# EAGLE design bbtc-logic (EAGLE 6.5.0)
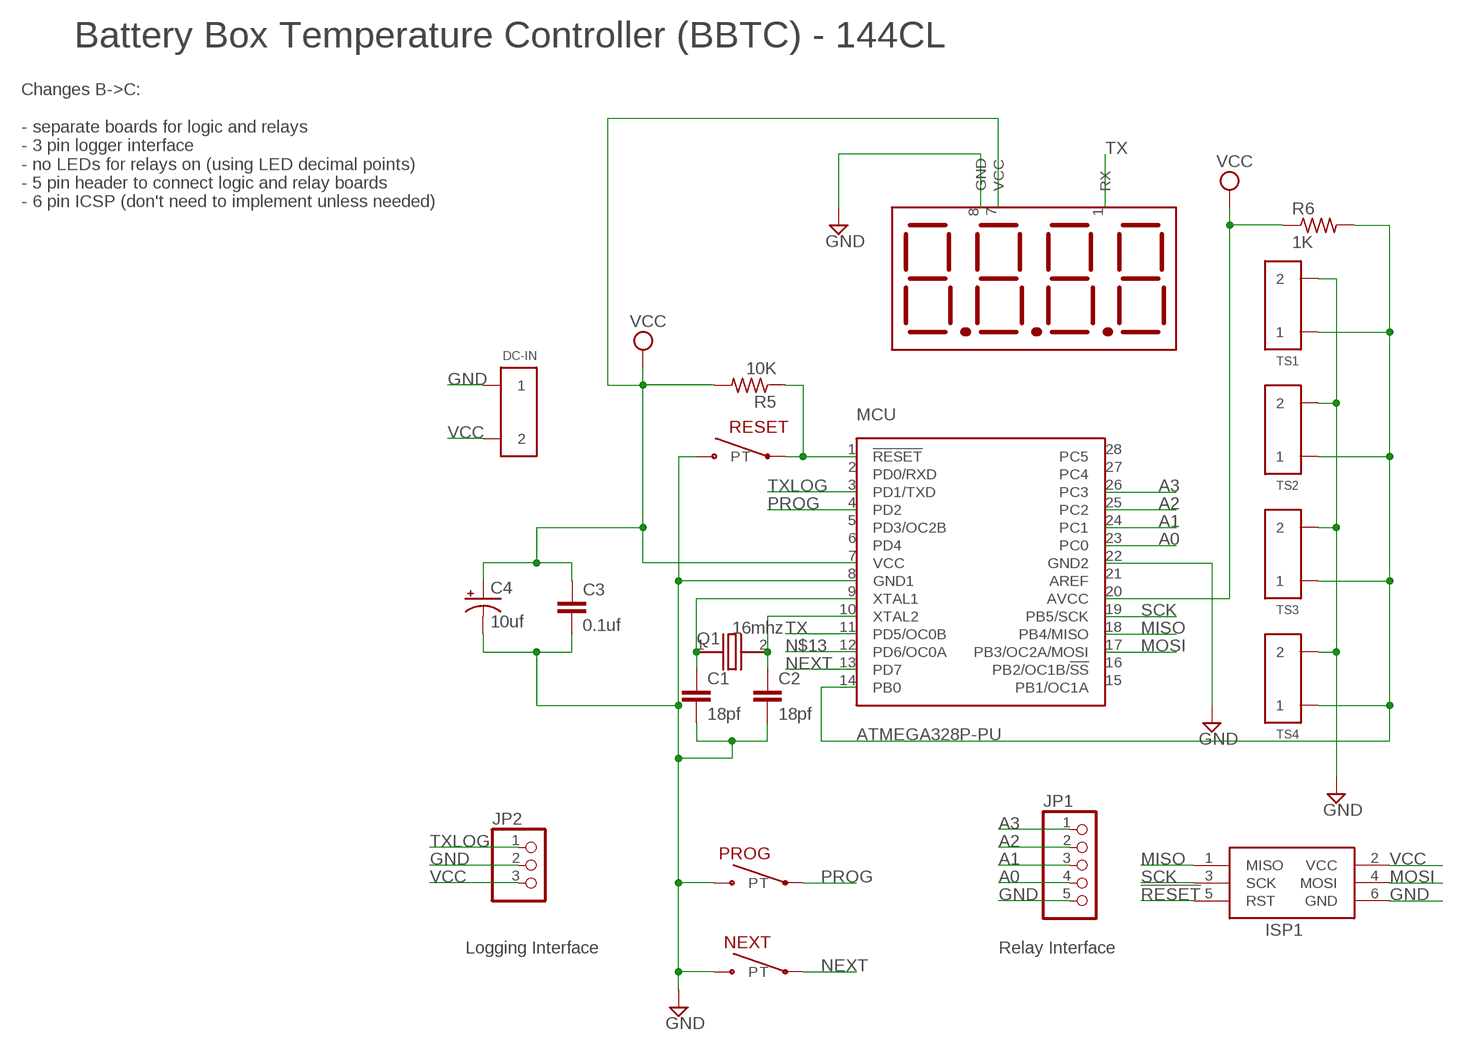
[diagram p0: schematic, sheet 1]

## Parts
4-DIG-DISPLAY  4-DIGIT-DISPLAY  [3SIL-OF-8]
C1  18pf  C-EUC0805  [C0805]
C2  18pf  C-EUC0805  [C0805]
C3  0.1uf  C-EUC0805  [C0805]
C4  10uf  CPOL-USE2-4  [E2-4]
DC-IN  SCREW-CLAMP-1255  [SCREW-CLAMP-ADAFRUIT-2X3.5MM]
ISP1  AVRISP-6  [AVRISP]
JP1  PINHD-1X5  [1X05]
JP2  PINHD-1X3  [1X03]
MCU  ATMEGA328P-PU  [DIL28-3]
NEXT  SWITCH-SPST-NEW  [SWITCH-ADAFRUIT-6MM-SLIM]
PROG  SWITCH-SPST-NEW  [SWITCH-ADAFRUIT-6MM-SLIM]
Q1  16mhz  CRYSTAL-5X3.2MM1024  [CRYSTAL-5X3.2MM-1024]
R5  10K  R-US_R0805  [R0805]
R6  1K  R-US_M0805  [M0805]
RESET  SWITCH-SPST-NEW  [SWITCH-ADAFRUIT-6MM-SLIM]
TS1  SCREW-CLAMP-1255  [SCREW-CLAMP-ADAFRUIT-2X3.5MM]
TS2  SCREW-CLAMP-1255  [SCREW-CLAMP-ADAFRUIT-2X3.5MM]
TS3  SCREW-CLAMP-1255  [SCREW-CLAMP-ADAFRUIT-2X3.5MM]
TS4  SCREW-CLAMP-1255  [SCREW-CLAMP-ADAFRUIT-2X3.5MM]

## Nets
1W: MCU.14(PB0) R6.2 TS1.1 TS2.1 TS3.1 TS4.1
!RESET: ISP1.5(RST) MCU.1(!RESET) R5.1 RESET.T
A0: JP1.4 MCU.23(PC0)
A1: JP1.3 MCU.24(PC1)
A2: JP1.2 MCU.25(PC2)
A3: JP1.1 MCU.26(PC3)
GND: 4-DIG-DISPLAY.8(GND) C1.2 C2.2 C3.2 C4.- DC-IN.1 ISP1.6(GND) JP1.5 JP2.2 MCU.8(GND1) MCU.22(GND2) NEXT.P PROG.P RESET.P TS1.2 TS2.2 TS3.2 TS4.2
MISO: ISP1.1(MISO) MCU.18(PB4/MISO)
MOSI: ISP1.4(MOSI) MCU.17(PB3/OC2A/MOSI)
N$4: C1.1 MCU.9(XTAL1) Q1.1
N$7: C2.1 MCU.10(XTAL2) Q1.2
N$13: MCU.12(PD6/OC0A)
NEXT: MCU.13(PD7) NEXT.T
PROG: MCU.4(PD2) PROG.T
SCK: ISP1.3(SCK) MCU.19(PB5/SCK)
TX: 4-DIG-DISPLAY.1(RX) MCU.11(PD5/OC0B)
TXLOG: JP2.1 MCU.3(PD1/TXD)
VCC: 4-DIG-DISPLAY.7(VCC) C3.1 C4.+ DC-IN.2 ISP1.2(VCC) JP2.3 MCU.7(VCC) MCU.20(AVCC) R5.2 R6.1
Unconnected: MCU.2(PD0/RXD) MCU.5(PD3/OC2B) MCU.6(PD4) MCU.15(PB1/OC1A) MCU.16(PB2/OC1B/!SS) MCU.21(AREF) MCU.27(PC4) MCU.28(PC5)

## Notes on the sheet
- Battery Box Temperature Controller (BBTC) - 144CL
- Changes B->C:
  
  - separate boards for logic and relays
  - 3 pin logger interface
  - no LEDs for relays on (using LED decimal points)
  - 5 pin header to connect logic and relay boards
  - 6 pin ICSP (don't need to implement unless needed)
- Logging Interface | Relay Interface

## Library data of the parts
4-DIG-DISPLAY = trl:4-DIGIT-DISPLAY
C1-C3 = rcl:C-EU: CAPACITOR, European symbol
C4 = rcl:CPOL-US: POLARIZED CAPACITOR, American symbol
DC-IN TS1-TS4 = trl:SCREW-CLAMP-1255
ISP1 = adafruit:AVRISP: AVR ISP HEADER Standard 6 pin header for AVR programming
JP1 = pinhead:PINHD-1X5: PIN HEADER
JP2 = pinhead:PINHD-1X3: PIN HEADER
MCU = trl:ATMEGA328P-PU
NEXT PROG RESET = trl:SWITCH-SPST-NEW
Q1 = trl:CRYSTAL-5X3.2MM
R5 = rcl:R-US_: RESISTOR, American symbol
R6 = resistor:R-US_: RESISTOR, American symbol

## Board
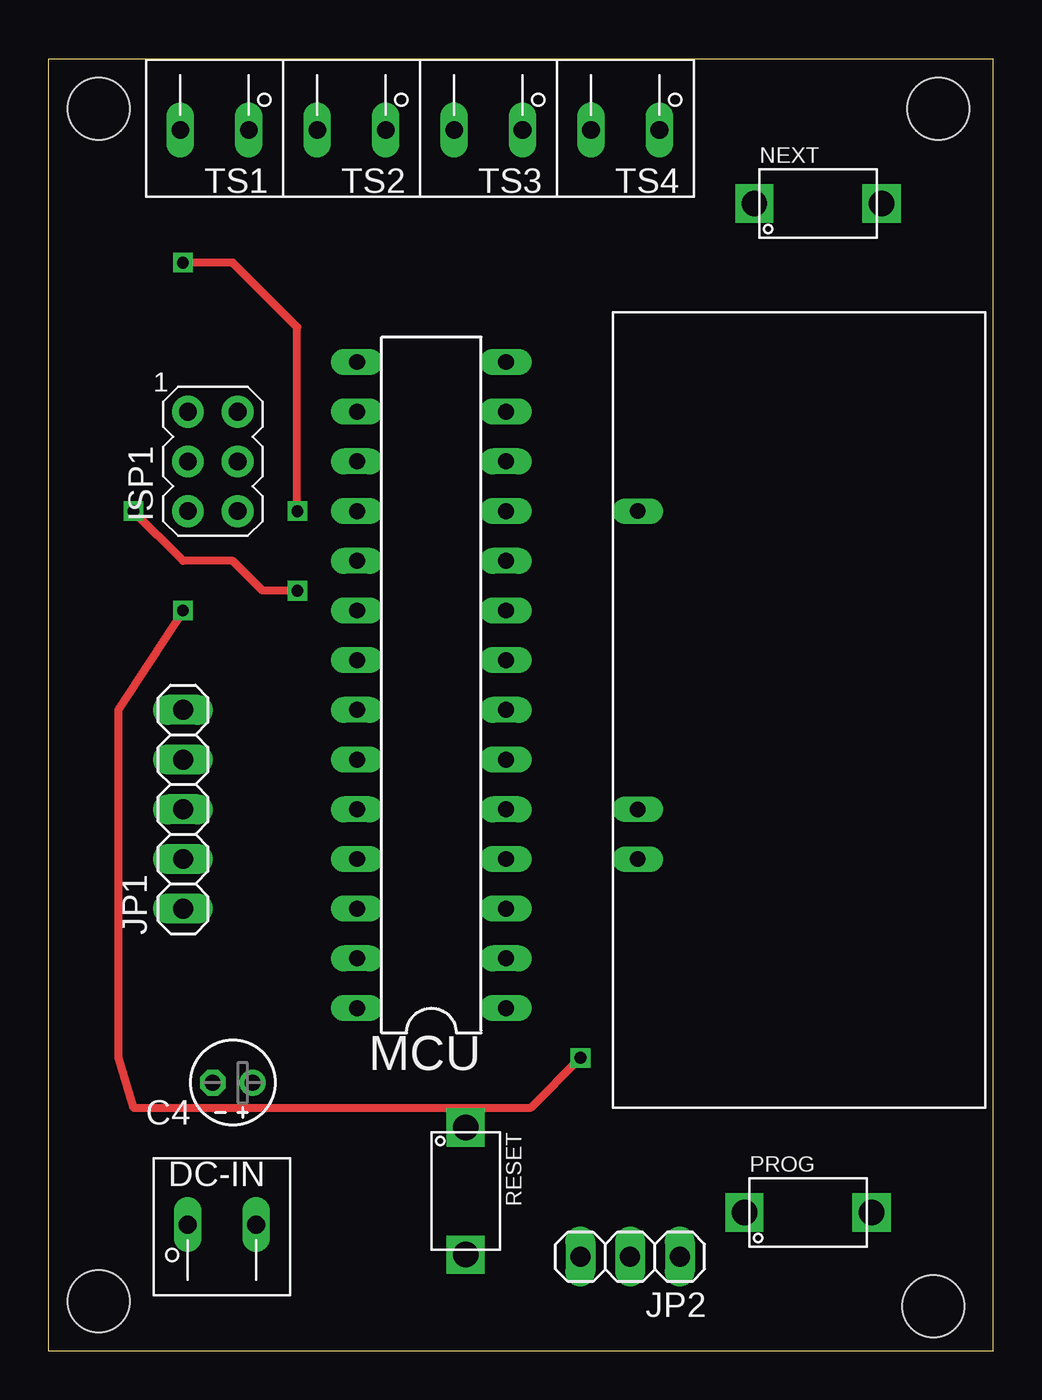
[diagram p1: board, top side]
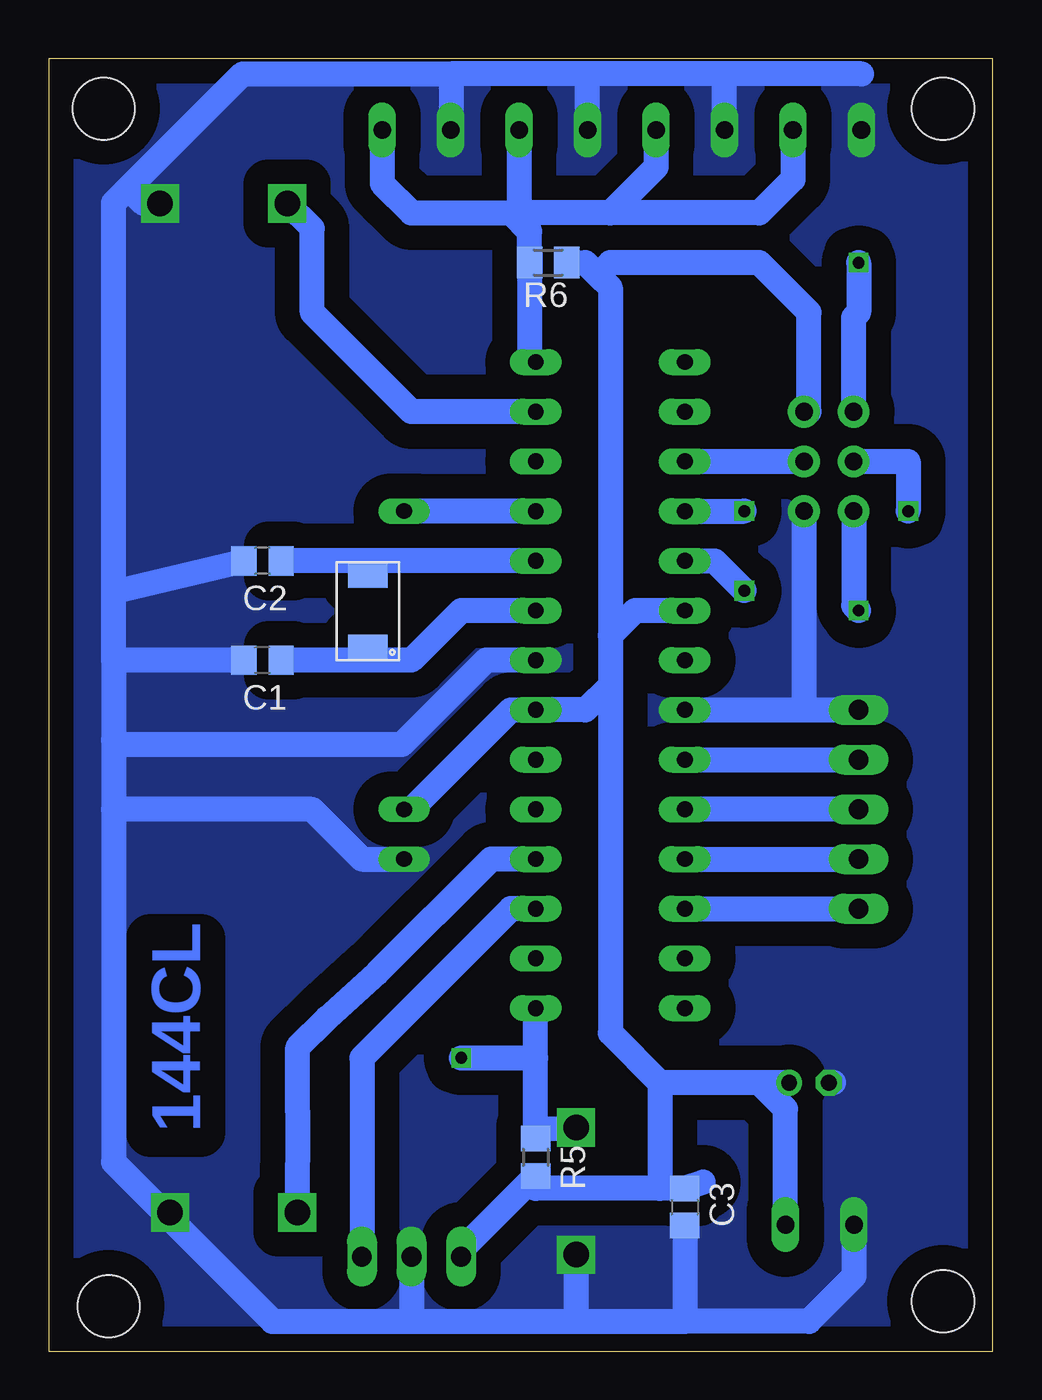
[diagram p2: board, bottom side, seen from below]

Size 48.26 x 66.04 mm. Coordinates in mm from the lower left corner, seen from the top.
Outline: 0,66.04 48.26,66.04 48.26,0 0,0 0,66.04
Copper layers (1*16): Top 0.035mm / dielectric 1.5mm / Bottom 0.035mm
Design rules "default": minimum track width 10mil, minimum drill 24mil, track to track 8mil, track to pad 8mil, pad to pad 8mil, via to via 8mil, smd to smd 8mil, copper to edge 40mil, drill to drill 8mil, minimum pad ring 10mil, minimum via ring 8mil, stop-mask expansion 4mil, vias tented up to drill 0mil, thermal gap 10mil
Holes 3.17 mm at 2.54,63.5 45.47,63.5 45.21,2.29 2.54,2.54

### Footprints (pad centres in the part's own frame; a part is rotated, then mirrored left to right if it is on the bottom)
3SIL-OF-8 = drill 0.8 long: 1 30.48,-1.27; 7 15.24,-1.27; 8 12.7,-1.27
C0805 = smd 1.3 x 1.5: 1 -0.95,0; 2 0.95,0
E2-4 = drill 0.813 pad 1.27: + -1.016,0 | drill 0.813 pad 1.27 octagon: - 1.016,0
SCREW-CLAMP-ADAFRUIT-2X3.5MM = drill 0.9 long: 1 1.75,3.6; 2 5.25,3.6
AVRISP = drill 0.9 pad 1.626: 1 -1.27,2.54; 2 1.27,2.54; 3 -1.27,0; 4 1.27,0; 5 -1.27,-2.54; 6 1.27,-2.54
1X05 = drill 1.016 long: 1 -5.08,0; 2 -2.54,0; 3 0,0; 4 2.54,0; 5 5.08,0
1X03 = drill 1.016 long: 1 -2.54,0; 2 0,0; 3 2.54,0
DIL28-3 = drill 0.813 long: 1 -16.51,-3.81; 2 -13.97,-3.81; 3 -11.43,-3.81; 4 -8.89,-3.81; 5 -6.35,-3.81; 6 -3.81,-3.81; 7 -1.27,-3.81; 8 1.27,-3.81; 9 3.81,-3.81; 10 6.35,-3.81; 11 8.89,-3.81; 12 11.43,-3.81; 13 13.97,-3.81; 14 16.51,-3.81; 15 16.51,3.81; 16 13.97,3.81; 17 11.43,3.81; 18 8.89,3.81; 19 6.35,3.81; 20 3.81,3.81; 21 1.27,3.81; 22 -1.27,3.81; 23 -3.81,3.81; 24 -6.35,3.81; 25 -8.89,3.81; 26 -11.43,3.81; 27 -13.97,3.81; 28 -16.51,3.81
SWITCH-ADAFRUIT-6MM-SLIM = drill 1.3 square: P 3.71,0.48; T -2.79,0.48
CRYSTAL-5X3.2MM-1024 = smd 1.3 x 2: 1 0.65,1.6; 2 4.35,1.6
R0805 = smd 1.3 x 1.5: 1 -0.95,0; 2 0.95,0
M0805 = smd 1.3 x 1.6: 1 -0.95,0; 2 0.95,0

### Placement (x,y rotation side)
4-DIG-DISPLAY  28.83,12.45 90 top
C1  37.34,35.31 180 bottom
C2  37.34,40.39 180 bottom
C3  15.75,7.37 270 bottom
C4  9.4,13.72 180 top
DC-IN  5.35,2.86 0 top
ISP1  8.38,45.47 0 top
JP1  6.86,27.69 90 top
JP2  29.72,4.83 180 top
MCU  19.56,34.04 90 top
NEXT  38.86,58.17 0 top
PROG  38.35,6.6 0 top
Q1  30.35,35.31 90 bottom
R5  23.37,9.91 270 bottom
R6  22.73,55.63 180 bottom
RESET  20.83,8.64 270 top
TS1  11.97,66 180 top
TS2  18.97,66 180 top
TS3  25.97,66 180 top
TS4  32.97,66 180 top

### Tracks (layer width: path | path; a pad name or v marks a point on that pad's centre or on a via)
1W
  Bottom 0.813: 24.22,58.59 24.64,58.17
  Bottom 1.27: 24.64,58.17 23.68,57.21 R6.2 23.68,50.86 MCU.14 | TS4.1 31.22,59.67 29.72,58.17 24.64,58.17 | TS3.1 24.22,58.59 | TS2.1 17.22,60.51 19.56,58.17 | 19.56,58.17 24.64,58.17 | TS1.1 10.22,59.89 11.94,58.17 19.56,58.17
!RESET  (via drill 0.6)
  Top 0.406: v6.86,37.85 3.56,32.77 3.56,14.99 4.32,12.45 24.64,12.45 v27.18,14.99
  Bottom 1.27: RESET.T 23.28,11.36 R5.1 23.37,14.99 | 23.37,14.99 MCU.1 | ISP1.5 7.11,38.1 v6.86,37.85 | v27.18,14.99 23.37,14.99
A0
  Bottom 1.27: MCU.23 JP1.4
A1
  Bottom 1.27: JP1.3 MCU.24
A2
  Bottom 1.27: MCU.25 JP1.2
A3
  Bottom 1.27: MCU.26 JP1.1
GND
  Bottom 1.27: 4-DIG-DISPLAY.8 32.26,25.15 34.8,27.69 44.96,27.69 | 44.96,38.8 C2.2 | C1.2 44.96,35.31 | 44.96,38.8 44.96,58.67 44.2,59.44 | 44.96,35.31 44.96,38.8 | 44.96,35.31 44.96,31.24 | 44.96,31.24 44.96,27.69 | 44.96,27.69 44.96,9.65 42.39,7.08 | 42.39,7.08 36.83,1.52 29.72,1.52 | 29.72,1.52 21.34,1.52 | 21.34,1.52 15.75,1.52 | C3.2 15.75,1.52 | RESET.P 21.31,1.55 21.34,1.52 | PROG.P 42.39,7.08 | MCU.8 25.91,35.31 30.23,30.99 44.7,30.99 44.96,31.24 | DC-IN.1 7.1,3.83 9.4,1.52 15.75,1.52 | C4.- 8.13,13.72 | JP2.2 29.72,1.52 | MCU.22 9.4,32.77 | 9.4,32.77 JP1.5 | ISP1.6 9.65,33.02 9.4,32.77 | 6.72,65.28 13.72,65.28 | 13.72,65.28 20.72,65.28 | 27.69,65.02 27.69,65.28 20.72,65.28 | 27.69,65.02 27.69,62.4 TS4.2 | TS2.2 13.72,65.28 | TS3.2 20.72,65.28 | 44.2,59.44 38.35,65.28 27.94,65.28 27.69,65.02 | NEXT.P 43.41,58.65 44.2,59.44
  pour Bottom (isolate 1.27, no thermals): 0,67.31 48.26,67.31 48.26,0 0.25,0
MISO  (via drill 0.6)
  Top 0.406: v12.7,42.93 12.7,52.32 9.4,55.63 v6.86,55.63
  Bottom 1.27: ISP1.1 7.11,52.83 6.86,53.09 v6.86,55.63 | MCU.18 v12.7,42.93
MOSI
  Bottom 1.27: MCU.17 ISP1.4
N$4
  Bottom 1.27: MCU.9 27.18,37.85 29.72,35.31 32.26,35.31 | 32.26,35.31 C1.1 | Q1.1 31.95,35.61 32.26,35.31
N$7
  Bottom 1.27: MCU.10 32.26,40.39 | 32.26,40.39 C2.1 | Q1.2 31.95,40.08 32.26,40.39
NEXT
  Bottom 1.27: MCU.13 29.72,48.01 34.8,53.09 34.8,57.37 NEXT.T
PROG
  Bottom 1.27: MCU.4 25.65,25.15 31.5,19.3 34.04,17.02 35.54,15.52 35.54,12.19 PROG.T
SCK  (via drill 0.6)
  Top 0.406: v12.7,38.86 10.92,38.86 9.4,40.39 6.86,40.39 v4.32,42.93
  Bottom 1.27: ISP1.3 4.32,45.47 v4.32,42.93 | MCU.19 14.22,40.39 v12.7,38.86
TX
  Bottom 1.27: MCU.11 4-DIG-DISPLAY.1
TXLOG
  Bottom 1.27: MCU.3 24.64,22.61 32.26,14.99 JP2.1
VCC
  Bottom 0.813: R5.2 23.37,8.32
  Bottom 1.27: 14.8,8.64 C3.1 17.02,8.32 | R6.1 20.83,55.63 20.19,54.99 | 20.19,54.99 19.56,54.36 19.56,36.58 | MCU.20 18.29,37.85 19.56,36.58 | 17.02,8.32 23.37,8.32 | 19.56,36.58 19.56,34.04 | 19.56,34.04 19.56,16.26 17.02,13.72 | 17.02,13.72 17.02,8.32 | 19.56,34.04 20.83,32.77 MCU.7 24.64,32.77 29.72,27.69 4-DIG-DISPLAY.7 | C4.+ 11.94,13.72 | 11.94,13.72 17.02,13.72 | DC-IN.2 10.6,12.37 11.94,13.72 | JP2.3 27.18,5.15 R5.2 | ISP1.2 9.4,48.01 9.4,53.09 11.94,55.63 19.56,55.63 20.19,54.99

### Text on the board
Bottom: 144CL